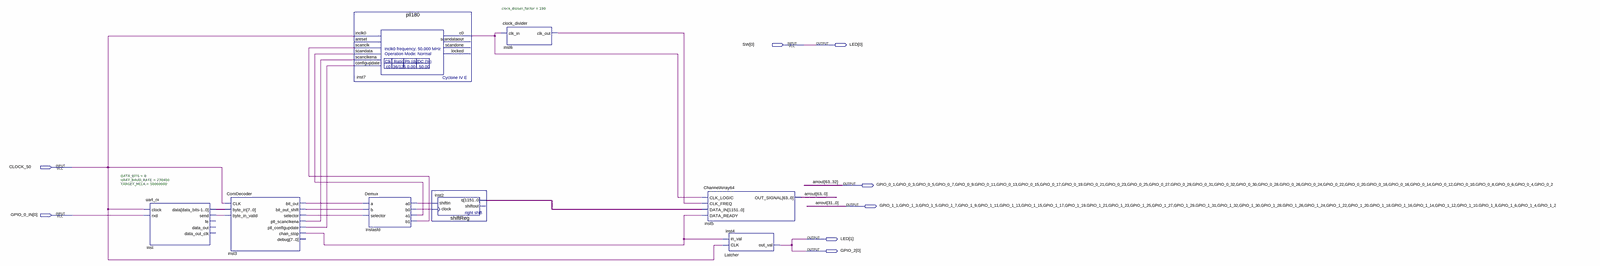
[diagram p0: schematic sheet, whole]
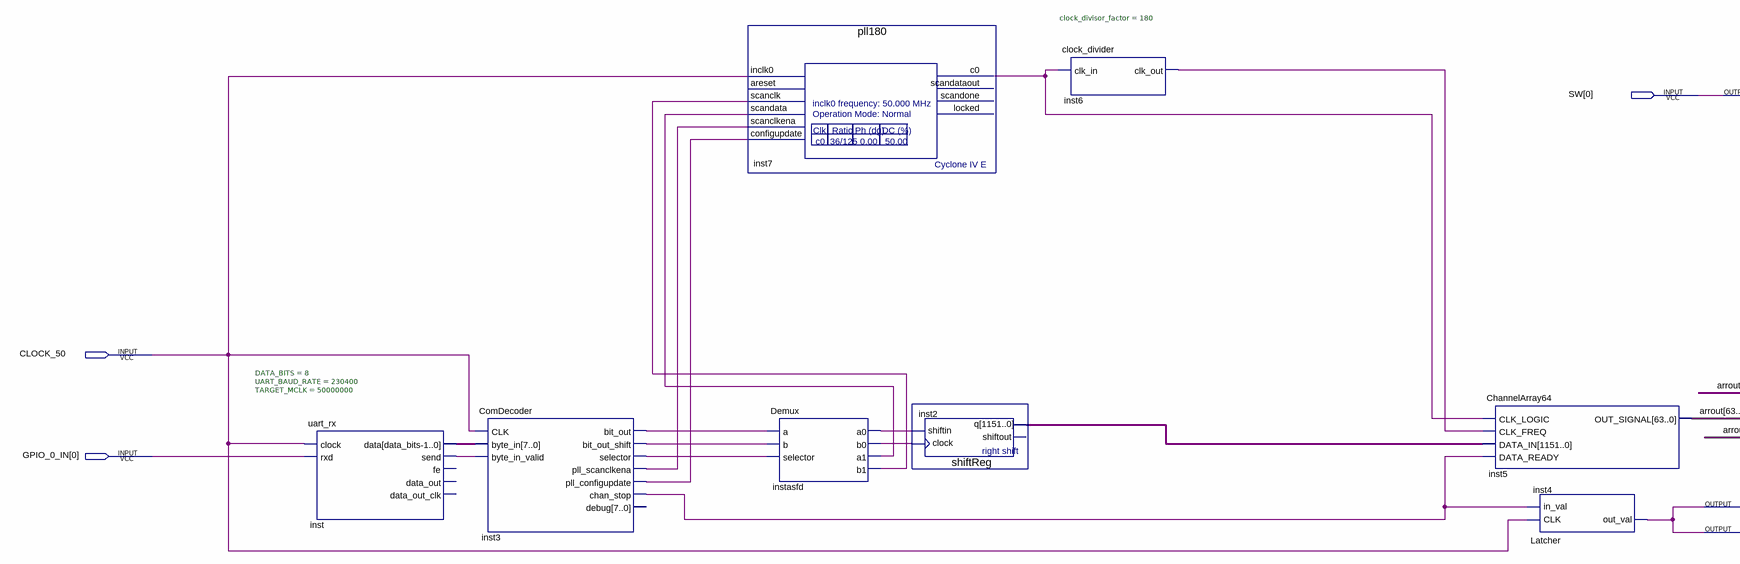
[diagram p1: schematic sheet, left part]
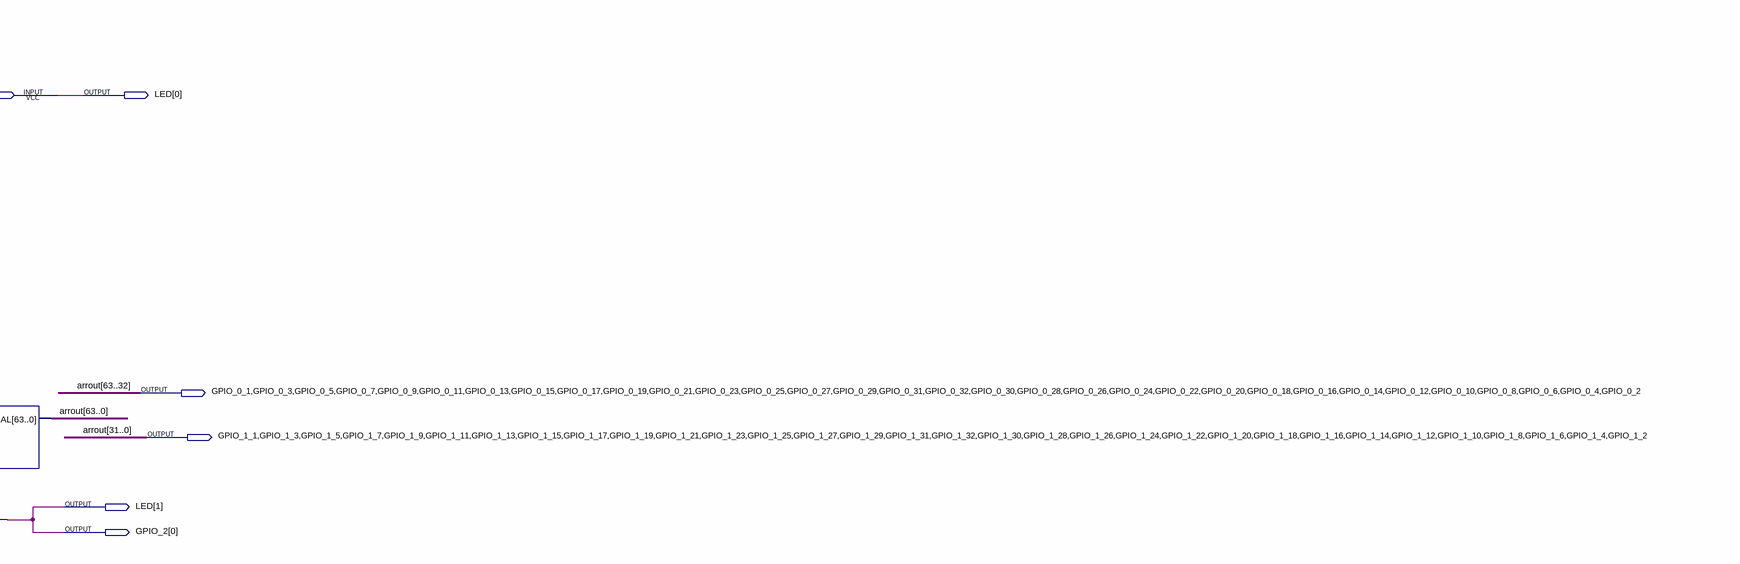
[diagram p2: schematic sheet, right part]
// Quartus schematic ShiftedSignalGenerator.bdf as structural Verilog: 8 symbols, 8 pins
module ShiftedSignalGenerator (
  input  [0:0] SW,
  input  CLOCK_50,
  input  [0:0] GPIO_0_IN,
  output [1:0] LED,
  output GPIO_0_1,
  output GPIO_0_3,
  output GPIO_0_5,
  output GPIO_0_7,
  output GPIO_0_9,
  output GPIO_0_11,
  output GPIO_0_13,
  output GPIO_0_15,
  output GPIO_0_17,
  output GPIO_0_19,
  output GPIO_0_21,
  output GPIO_0_23,
  output GPIO_0_25,
  output GPIO_0_27,
  output GPIO_0_29,
  output GPIO_0_31,
  output GPIO_0_32,
  output GPIO_0_30,
  output GPIO_0_28,
  output GPIO_0_26,
  output GPIO_0_24,
  output GPIO_0_22,
  output GPIO_0_20,
  output GPIO_0_18,
  output GPIO_0_16,
  output GPIO_0_14,
  output GPIO_0_12,
  output GPIO_0_10,
  output GPIO_0_8,
  output GPIO_0_6,
  output GPIO_0_4,
  output GPIO_0_2,
  output GPIO_1_1,
  output GPIO_1_3,
  output GPIO_1_5,
  output GPIO_1_7,
  output GPIO_1_9,
  output GPIO_1_11,
  output GPIO_1_13,
  output GPIO_1_15,
  output GPIO_1_17,
  output GPIO_1_19,
  output GPIO_1_21,
  output GPIO_1_23,
  output GPIO_1_25,
  output GPIO_1_27,
  output GPIO_1_29,
  output GPIO_1_31,
  output GPIO_1_32,
  output GPIO_1_30,
  output GPIO_1_28,
  output GPIO_1_26,
  output GPIO_1_24,
  output GPIO_1_22,
  output GPIO_1_20,
  output GPIO_1_18,
  output GPIO_1_16,
  output GPIO_1_14,
  output GPIO_1_12,
  output GPIO_1_10,
  output GPIO_1_8,
  output GPIO_1_6,
  output GPIO_1_4,
  output GPIO_1_2,
  output [0:0] GPIO_2
);

  wire inst3_bit_out, inst3_bit_out_shift, inst3_chan_stop, inst3_pll_configupdate, inst3_pll_scanclkena,
       inst3_selector, inst6_clk_out, inst7_c0, inst_send, instasfd_a0, instasfd_a1, instasfd_b0, instasfd_b1;
  wire [7:0] inst_data;
  wire [1151:0] inst2_q;

  uart_rx #(.DATA_BITS(8), .UART_BAUD_RATE(230400), .TARGET_MCLK(50000000)) inst (
    .clock(CLOCK_50), .rxd(GPIO_0_IN[0]), .data(inst_data), .send(inst_send));  // open: fe, data_out, data_out_clk
  ComDecoder inst3 (
    .CLK(CLOCK_50), .byte_in(inst_data), .byte_in_valid(inst_send), .bit_out(inst3_bit_out),
    .bit_out_shift(inst3_bit_out_shift), .selector(inst3_selector), .pll_scanclkena(inst3_pll_scanclkena),
    .pll_configupdate(inst3_pll_configupdate), .chan_stop(inst3_chan_stop));  // open: debug
  pll180 inst7 (
    .inclk0(CLOCK_50), .scanclk(instasfd_b1), .scandata(instasfd_a1), .scanclkena(inst3_pll_scanclkena),
    .configupdate(inst3_pll_configupdate), .c0(inst7_c0));  // open: areset, scandataout, scandone, locked
  Demux instasfd (
    .a(inst3_bit_out), .b(inst3_bit_out_shift), .selector(inst3_selector), .a0(instasfd_a0),
    .b0(instasfd_b0), .a1(instasfd_a1), .b1(instasfd_b1));
  shiftReg inst2 (.clock(instasfd_b0), .shiftin(instasfd_a0), .q(inst2_q));  // open: shiftout
  clock_divider #(.clock_divisor_factor(180)) inst6 (.clk_in(inst7_c0), .clk_out(inst6_clk_out));
  ChannelArray64 inst5 (
    .CLK_LOGIC(inst7_c0), .CLK_FREQ(inst6_clk_out), .DATA_IN(inst2_q), .DATA_READY(inst3_chan_stop),
    .OUT_SIGNAL({GPIO_0_1, GPIO_0_3, GPIO_0_5, GPIO_0_7, GPIO_0_9, GPIO_0_11, GPIO_0_13, GPIO_0_15, GPIO_0_17, GPIO_0_19, GPIO_0_21, GPIO_0_23, GPIO_0_25, GPIO_0_27, GPIO_0_29, GPIO_0_31, GPIO_0_32, GPIO_0_30, GPIO_0_28, GPIO_0_26, GPIO_0_24, GPIO_0_22, GPIO_0_20, GPIO_0_18, GPIO_0_16, GPIO_0_14, GPIO_0_12, GPIO_0_10, GPIO_0_8, GPIO_0_6, GPIO_0_4, GPIO_0_2, GPIO_1_1, GPIO_1_3, GPIO_1_5, GPIO_1_7, GPIO_1_9, GPIO_1_11, GPIO_1_13, GPIO_1_15, GPIO_1_17, GPIO_1_19, GPIO_1_21, GPIO_1_23, GPIO_1_25, GPIO_1_27, GPIO_1_29, GPIO_1_31, GPIO_1_32, GPIO_1_30, GPIO_1_28, GPIO_1_26, GPIO_1_24, GPIO_1_22, GPIO_1_20, GPIO_1_18, GPIO_1_16, GPIO_1_14, GPIO_1_12, GPIO_1_10, GPIO_1_8, GPIO_1_6, GPIO_1_4, GPIO_1_2}));
  Latcher inst4 (.CLK(CLOCK_50), .in_val(inst3_chan_stop), .out_val(GPIO_2[0]));

  assign LED = {GPIO_2[0], SW[0]};

  // Other names for the same wires on the sheet: arrout[63:0] = {GPIO_0_1, GPIO_0_3, GPIO_0_5, GPIO_0_7, GPIO_0_9, GPIO_0_11, GPIO_0_13, GPIO_0_15, GPIO_0_17, GPIO_0_19, GPIO_0_21, GPIO_0_23, GPIO_0_25, GPIO_0_27, GPIO_0_29, GPIO_0_31, GPIO_0_32, GPIO_0_30, GPIO_0_28, GPIO_0_26, GPIO_0_24, GPIO_0_22, GPIO_0_20, GPIO_0_18, GPIO_0_16, GPIO_0_14, GPIO_0_12, GPIO_0_10, GPIO_0_8, GPIO_0_6, GPIO_0_4, GPIO_0_2, GPIO_1_1, GPIO_1_3, GPIO_1_5, GPIO_1_7, GPIO_1_9, GPIO_1_11, GPIO_1_13, GPIO_1_15, GPIO_1_17, GPIO_1_19, GPIO_1_21, GPIO_1_23, GPIO_1_25, GPIO_1_27, GPIO_1_29, GPIO_1_31, GPIO_1_32, GPIO_1_30, GPIO_1_28, GPIO_1_26, GPIO_1_24, GPIO_1_22, GPIO_1_20, GPIO_1_18, GPIO_1_16, GPIO_1_14, GPIO_1_12, GPIO_1_10, GPIO_1_8, GPIO_1_6, GPIO_1_4, GPIO_1_2}
endmodule
